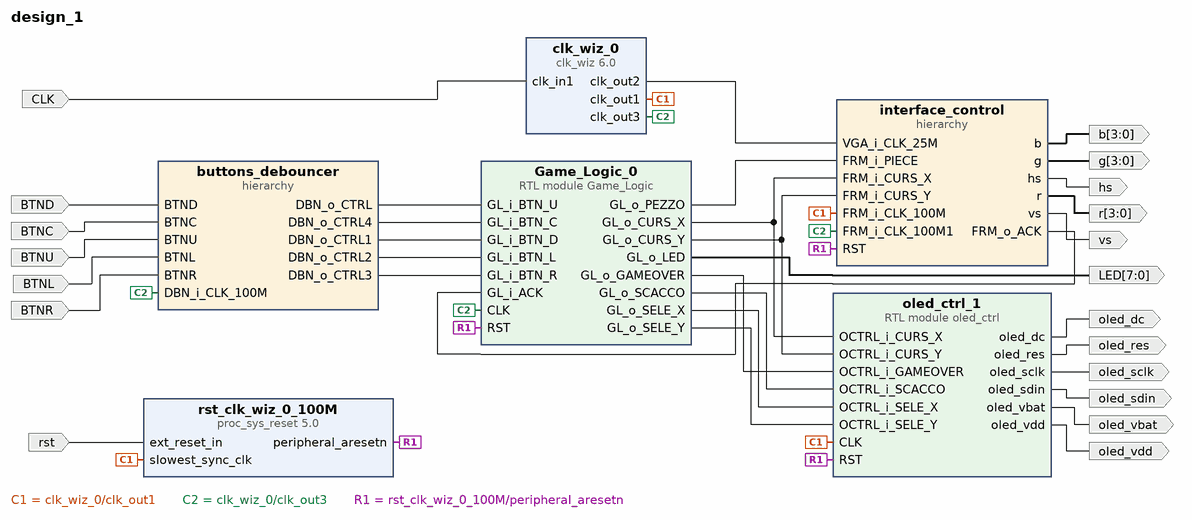
[diagram p0: block diagram of the top level]
# Vivado block design design_1, xc7z020clg484-1, Vivado 2022.1
create_bd_design design_1

create_bd_port -dir O -from 3 -to 0 b
create_bd_port -dir O -from 3 -to 0 g
create_bd_port -dir O -from 3 -to 0 r
create_bd_port -dir O hs
create_bd_port -dir O vs
create_bd_port -dir O -from 7 -to 0 LED
create_bd_port -dir I -type clk CLK
create_bd_port -dir I BTND
create_bd_port -dir I BTNC
create_bd_port -dir I BTNU
create_bd_port -dir I BTNL
create_bd_port -dir I BTNR
create_bd_port -dir O oled_sdin
create_bd_port -dir O oled_dc
create_bd_port -dir O oled_sclk
create_bd_port -dir O oled_res
create_bd_port -dir O oled_vbat
create_bd_port -dir O oled_vdd
create_bd_port -dir I -type rst rst
set_property -dict {CONFIG.POLARITY ACTIVE_LOW} [get_bd_ports rst]

create_bd_cell -type ip -vlnv xilinx.com:ip:clk_wiz:6.0 clk_wiz_0
set_property -dict [list \
  CONFIG.CLKOUT1_JITTER 130.958 \
  CONFIG.CLKOUT1_PHASE_ERROR 98.575 \
  CONFIG.CLKOUT1_REQUESTED_OUT_FREQ 100 \
  CONFIG.CLKOUT2_JITTER 175.402 \
  CONFIG.CLKOUT2_PHASE_ERROR 98.575 \
  CONFIG.CLKOUT2_REQUESTED_DUTY_CYCLE 25 \
  CONFIG.CLKOUT2_REQUESTED_OUT_FREQ 25 \
  CONFIG.CLKOUT2_USED true \
  CONFIG.CLKOUT3_JITTER 151.636 \
  CONFIG.CLKOUT3_PHASE_ERROR 98.575 \
  CONFIG.CLKOUT3_REQUESTED_OUT_FREQ 50 \
  CONFIG.CLKOUT3_USED true \
  CONFIG.MMCM_CLKFBOUT_MULT_F 10.000 \
  CONFIG.MMCM_CLKOUT0_DIVIDE_F 10.000 \
  CONFIG.MMCM_CLKOUT1_DIVIDE 40 \
  CONFIG.MMCM_CLKOUT1_DUTY_CYCLE 0.250 \
  CONFIG.MMCM_CLKOUT2_DIVIDE 20 \
  CONFIG.NUM_OUT_CLKS 3 \
  CONFIG.USE_LOCKED false \
  CONFIG.USE_RESET false \
] [get_bd_cells clk_wiz_0]
create_bd_cell -type ip -vlnv xilinx.com:ip:proc_sys_reset:5.0 rst_clk_wiz_0_100M
create_bd_cell -type hier buttons_debouncer
create_bd_cell -type hier interface_control
create_bd_cell -type module -reference Game_Logic Game_Logic_0
create_bd_cell -type module -reference oled_ctrl oled_ctrl_1

# ---- hierarchy /buttons_debouncer ----
current_bd_instance /buttons_debouncer
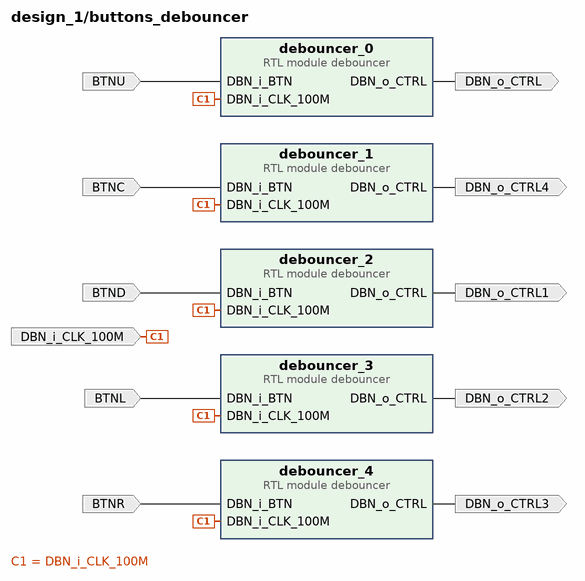
[diagram p1: block diagram inside /buttons_debouncer]
create_bd_pin -dir I DBN_i_CLK_100M
create_bd_pin -dir I BTNU
create_bd_pin -dir O DBN_o_CTRL
create_bd_pin -dir I BTND
create_bd_pin -dir O DBN_o_CTRL1
create_bd_pin -dir I BTNL
create_bd_pin -dir O DBN_o_CTRL2
create_bd_pin -dir I BTNR
create_bd_pin -dir O DBN_o_CTRL3
create_bd_pin -dir I BTNC
create_bd_pin -dir O DBN_o_CTRL4

create_bd_cell -type module -reference debouncer debouncer_0
create_bd_cell -type module -reference debouncer debouncer_2
create_bd_cell -type module -reference debouncer debouncer_3
create_bd_cell -type module -reference debouncer debouncer_4
create_bd_cell -type module -reference debouncer debouncer_1

# ---- hierarchy /interface_control ----
current_bd_instance /interface_control
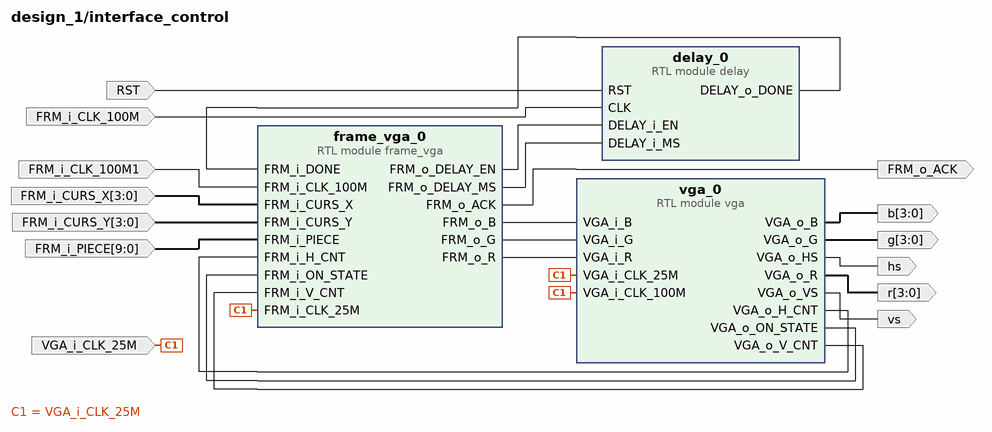
[diagram p2: block diagram inside /interface_control]
create_bd_pin -dir I VGA_i_CLK_25M
create_bd_pin -dir O -from 3 -to 0 r
create_bd_pin -dir O -from 3 -to 0 g
create_bd_pin -dir O -from 3 -to 0 b
create_bd_pin -dir O hs
create_bd_pin -dir O vs
create_bd_pin -dir O FRM_o_ACK
create_bd_pin -dir I -from 9 -to 0 FRM_i_PIECE
create_bd_pin -dir I FRM_i_CLK_100M
create_bd_pin -dir I -from 3 -to 0 FRM_i_CURS_X
create_bd_pin -dir I -from 3 -to 0 FRM_i_CURS_Y
create_bd_pin -dir I -type rst RST
create_bd_pin -dir I FRM_i_CLK_100M1

create_bd_cell -type module -reference delay delay_0
create_bd_cell -type module -reference vga vga_0
create_bd_cell -type module -reference frame_vga frame_vga_0

# ---- connections ----

current_bd_instance /buttons_debouncer
connect_bd_net -net DBN_i_BTN_0_1 [get_bd_pins BTND] [get_bd_pins debouncer_2/DBN_i_BTN]
connect_bd_net -net DBN_i_BTN_1_1 [get_bd_pins BTNC] [get_bd_pins debouncer_1/DBN_i_BTN]
connect_bd_net -net DBN_i_BTN_2_1 [get_bd_pins BTNU] [get_bd_pins debouncer_0/DBN_i_BTN]
connect_bd_net -net DBN_i_BTN_3_1 [get_bd_pins BTNL] [get_bd_pins debouncer_3/DBN_i_BTN]
connect_bd_net -net DBN_i_BTN_4_1 [get_bd_pins BTNR] [get_bd_pins debouncer_4/DBN_i_BTN]
connect_bd_net -net clk_wiz_0_clk_out1 [get_bd_pins DBN_i_CLK_100M] \
  [get_bd_pins debouncer_4/DBN_i_CLK_100M] [get_bd_pins debouncer_3/DBN_i_CLK_100M] [get_bd_pins debouncer_2/DBN_i_CLK_100M] \
  [get_bd_pins debouncer_1/DBN_i_CLK_100M] [get_bd_pins debouncer_0/DBN_i_CLK_100M]
connect_bd_net [get_bd_pins debouncer_0/DBN_o_CTRL] [get_bd_pins DBN_o_CTRL]
connect_bd_net [get_bd_pins debouncer_1/DBN_o_CTRL] [get_bd_pins DBN_o_CTRL4]
connect_bd_net [get_bd_pins debouncer_2/DBN_o_CTRL] [get_bd_pins DBN_o_CTRL1]
connect_bd_net [get_bd_pins debouncer_3/DBN_o_CTRL] [get_bd_pins DBN_o_CTRL2]
connect_bd_net [get_bd_pins debouncer_4/DBN_o_CTRL] [get_bd_pins DBN_o_CTRL3]

current_bd_instance /interface_control
connect_bd_net -net FRM_i_CLK_100M1_1 [get_bd_pins FRM_i_CLK_100M1] [get_bd_pins frame_vga_0/FRM_i_CLK_100M]
connect_bd_net [get_bd_pins FRM_i_CURS_X] [get_bd_pins frame_vga_0/FRM_i_CURS_X]
connect_bd_net [get_bd_pins FRM_i_CURS_Y] [get_bd_pins frame_vga_0/FRM_i_CURS_Y]
connect_bd_net -net Game_Logic_0_GL_o_PEZZO [get_bd_pins FRM_i_PIECE] [get_bd_pins frame_vga_0/FRM_i_PIECE]
connect_bd_net [get_bd_pins RST] [get_bd_pins delay_0/RST]
connect_bd_net -net clk_wiz_0_clk_out1 [get_bd_pins FRM_i_CLK_100M] [get_bd_pins delay_0/CLK]
connect_bd_net -net clk_wiz_0_clk_out2 [get_bd_pins VGA_i_CLK_25M] \
  [get_bd_pins vga_0/VGA_i_CLK_100M] [get_bd_pins vga_0/VGA_i_CLK_25M] [get_bd_pins frame_vga_0/FRM_i_CLK_25M]
connect_bd_net [get_bd_pins delay_0/DELAY_o_DONE] [get_bd_pins frame_vga_0/FRM_i_DONE]
connect_bd_net [get_bd_pins frame_vga_0/FRM_o_ACK] [get_bd_pins FRM_o_ACK]
connect_bd_net [get_bd_pins frame_vga_0/FRM_o_B] [get_bd_pins vga_0/VGA_i_B]
connect_bd_net [get_bd_pins frame_vga_0/FRM_o_DELAY_EN] [get_bd_pins delay_0/DELAY_i_EN]
connect_bd_net [get_bd_pins frame_vga_0/FRM_o_DELAY_MS] [get_bd_pins delay_0/DELAY_i_MS]
connect_bd_net [get_bd_pins frame_vga_0/FRM_o_G] [get_bd_pins vga_0/VGA_i_G]
connect_bd_net [get_bd_pins frame_vga_0/FRM_o_R] [get_bd_pins vga_0/VGA_i_R]
connect_bd_net [get_bd_pins vga_0/VGA_o_B] [get_bd_pins b]
connect_bd_net [get_bd_pins vga_0/VGA_o_G] [get_bd_pins g]
connect_bd_net [get_bd_pins vga_0/VGA_o_HS] [get_bd_pins hs]
connect_bd_net [get_bd_pins vga_0/VGA_o_H_CNT] [get_bd_pins frame_vga_0/FRM_i_H_CNT]
connect_bd_net [get_bd_pins vga_0/VGA_o_ON_STATE] [get_bd_pins frame_vga_0/FRM_i_ON_STATE]
connect_bd_net [get_bd_pins vga_0/VGA_o_R] [get_bd_pins r]
connect_bd_net [get_bd_pins vga_0/VGA_o_VS] [get_bd_pins vs]
connect_bd_net [get_bd_pins vga_0/VGA_o_V_CNT] [get_bd_pins frame_vga_0/FRM_i_V_CNT]

current_bd_instance /
connect_bd_net -net DBN_i_BTN_0_1 [get_bd_ports BTND] [get_bd_pins buttons_debouncer/BTND]
connect_bd_net -net DBN_i_BTN_1_1 [get_bd_ports BTNC] [get_bd_pins buttons_debouncer/BTNC]
connect_bd_net -net DBN_i_BTN_2_1 [get_bd_ports BTNU] [get_bd_pins buttons_debouncer/BTNU]
connect_bd_net -net DBN_i_BTN_3_1 [get_bd_ports BTNL] [get_bd_pins buttons_debouncer/BTNL]
connect_bd_net -net DBN_i_BTN_4_1 [get_bd_ports BTNR] [get_bd_pins buttons_debouncer/BTNR]
connect_bd_net [get_bd_pins Game_Logic_0/GL_o_CURS_X] [get_bd_pins interface_control/FRM_i_CURS_X] [get_bd_pins oled_ctrl_1/OCTRL_i_CURS_X]
connect_bd_net [get_bd_pins Game_Logic_0/GL_o_CURS_Y] [get_bd_pins interface_control/FRM_i_CURS_Y] [get_bd_pins oled_ctrl_1/OCTRL_i_CURS_Y]
connect_bd_net [get_bd_pins Game_Logic_0/GL_o_GAMEOVER] [get_bd_pins oled_ctrl_1/OCTRL_i_GAMEOVER]
connect_bd_net [get_bd_pins Game_Logic_0/GL_o_LED] [get_bd_ports LED]
connect_bd_net [get_bd_pins Game_Logic_0/GL_o_PEZZO] [get_bd_pins interface_control/FRM_i_PIECE]
connect_bd_net [get_bd_pins Game_Logic_0/GL_o_SCACCO] [get_bd_pins oled_ctrl_1/OCTRL_i_SCACCO]
connect_bd_net [get_bd_pins Game_Logic_0/GL_o_SELE_X] [get_bd_pins oled_ctrl_1/OCTRL_i_SELE_X]
connect_bd_net [get_bd_pins Game_Logic_0/GL_o_SELE_Y] [get_bd_pins oled_ctrl_1/OCTRL_i_SELE_Y]
connect_bd_net -net clk_in1_0_1 [get_bd_ports CLK] [get_bd_pins clk_wiz_0/clk_in1]
connect_bd_net [get_bd_pins clk_wiz_0/clk_out1] \
  [get_bd_pins oled_ctrl_1/CLK] [get_bd_pins interface_control/FRM_i_CLK_100M] \
  [get_bd_pins rst_clk_wiz_0_100M/slowest_sync_clk]
connect_bd_net [get_bd_pins clk_wiz_0/clk_out2] [get_bd_pins interface_control/VGA_i_CLK_25M]
connect_bd_net [get_bd_pins clk_wiz_0/clk_out3] \
  [get_bd_pins buttons_debouncer/DBN_i_CLK_100M] [get_bd_pins interface_control/FRM_i_CLK_100M1] \
  [get_bd_pins Game_Logic_0/CLK]
connect_bd_net -net debouncer_0_DBN_o_CTRL [get_bd_pins buttons_debouncer/DBN_o_CTRL] [get_bd_pins Game_Logic_0/GL_i_BTN_U]
connect_bd_net -net debouncer_1_DBN_o_CTRL [get_bd_pins buttons_debouncer/DBN_o_CTRL4] [get_bd_pins Game_Logic_0/GL_i_BTN_C]
connect_bd_net -net debouncer_2_DBN_o_CTRL [get_bd_pins buttons_debouncer/DBN_o_CTRL1] [get_bd_pins Game_Logic_0/GL_i_BTN_D]
connect_bd_net -net debouncer_3_DBN_o_CTRL [get_bd_pins buttons_debouncer/DBN_o_CTRL2] [get_bd_pins Game_Logic_0/GL_i_BTN_L]
connect_bd_net -net debouncer_4_DBN_o_CTRL [get_bd_pins buttons_debouncer/DBN_o_CTRL3] [get_bd_pins Game_Logic_0/GL_i_BTN_R]
connect_bd_net -net frame_vga_0_FRM_o_ACK [get_bd_pins interface_control/FRM_o_ACK] [get_bd_pins Game_Logic_0/GL_i_ACK]
connect_bd_net [get_bd_pins oled_ctrl_1/oled_dc] [get_bd_ports oled_dc]
connect_bd_net [get_bd_pins oled_ctrl_1/oled_res] [get_bd_ports oled_res]
connect_bd_net [get_bd_pins oled_ctrl_1/oled_sclk] [get_bd_ports oled_sclk]
connect_bd_net [get_bd_pins oled_ctrl_1/oled_sdin] [get_bd_ports oled_sdin]
connect_bd_net [get_bd_pins oled_ctrl_1/oled_vbat] [get_bd_ports oled_vbat]
connect_bd_net [get_bd_pins oled_ctrl_1/oled_vdd] [get_bd_ports oled_vdd]
connect_bd_net -net reset_rtl_1 [get_bd_ports rst] [get_bd_pins rst_clk_wiz_0_100M/ext_reset_in]
connect_bd_net [get_bd_pins rst_clk_wiz_0_100M/peripheral_aresetn] \
  [get_bd_pins interface_control/RST] [get_bd_pins Game_Logic_0/RST] [get_bd_pins oled_ctrl_1/RST]
connect_bd_net -net vga_0_VGA_o_B [get_bd_pins interface_control/b] [get_bd_ports b]
connect_bd_net -net vga_0_VGA_o_G [get_bd_pins interface_control/g] [get_bd_ports g]
connect_bd_net -net vga_0_VGA_o_HS [get_bd_pins interface_control/hs] [get_bd_ports hs]
connect_bd_net -net vga_0_VGA_o_R [get_bd_pins interface_control/r] [get_bd_ports r]
connect_bd_net -net vga_0_VGA_o_VS [get_bd_pins interface_control/vs] [get_bd_ports vs]

validate_bd_design
save_bd_design
